# EAGLE schematic board (EAGLE 6.3)
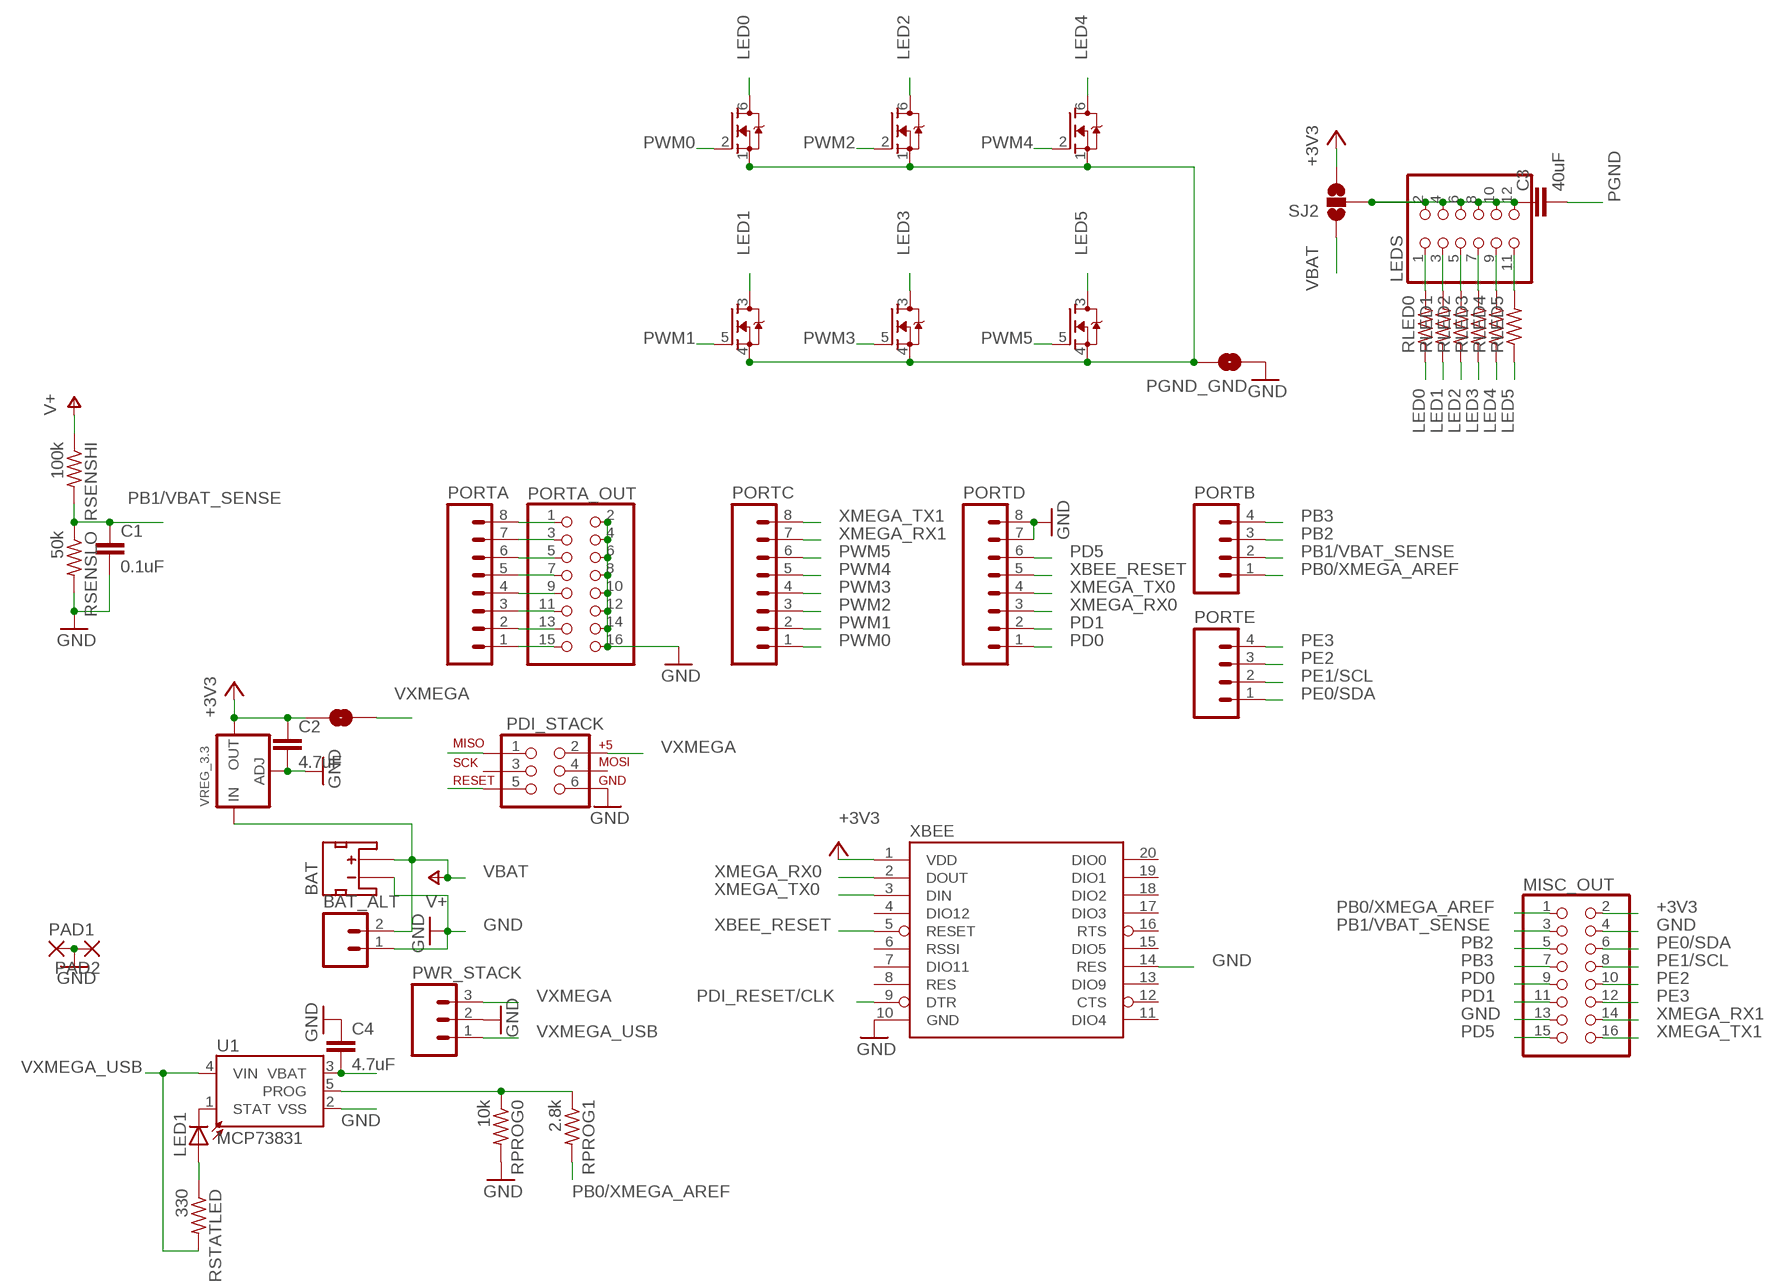
[diagram p0: schematic, sheet 1]

## Parts
+3.3V_VXMEGA  SOLDERJUMPERTRACE  [SJ_2S-TRACE]
BAT  JST_2MM_MALE  [JST-2-SMD]
BAT_ALT  M02PTH  [1X02]
C1  0.1uF  C-EUC0603K  [C0603K]
C2  4.7uF  C-EUC0805K  [C0805K]
C3  40uF  C-EUC1210  [C1210]
C4  4.7uF  C-EUC0805  [C0805]
DRV0  MOSFET-N_DUAL  [SOT363]
DRV1  MOSFET-N_DUAL  [SOT363]
DRV2  MOSFET-N_DUAL  [SOT363]
LED1  LEDCHIP-LED0603  [CHIP-LED0603]
LEDS  PINHD-2X6/90  [2X06/90]
MISC_OUT  PINHD-2X8/90  [2X08/90]
PAD1  3,81/1,4  [3,81/1,4]
PAD2  3,81/1,4  [3,81/1,4]
PDI_STACK  AVR_SPI_PRG_6NS  [2X3-NS]
PGND_GND  SOLDERJUMPERTRACE  [SJ_2S-TRACE]
PORTA  M081X08  [1X08]
PORTA_OUT  PINHD-2X8  [2X08]
PORTB  M04PTH  [1X04]
PORTC  M081X08  [1X08]
PORTD  M081X08  [1X08]
PORTE  M04PTH  [1X04]
PWR_STACK  M03PTH  [1X03]
RLED0  R-US_R0805  [R0805]
RLED1  R-US_R0805  [R0805]
RLED2  R-US_R0805  [R0805]
RLED3  R-US_R0805  [R0805]
RLED4  R-US_R0805  [R0805]
RLED5  R-US_R0805  [R0805]
RPROG0  10k  R-US_R0603  [R0603]
RPROG1  2.8k  R-US_R0603  [R0603]
RSENSHI  100k  R-US_R0603  [R0603]
RSENSLO  50k  R-US_R0603  [R0603]
RSTATLED  330  R-US_R0603  [R0603]
SJ2  SOLDERJUMPER_2WAY-OLDT  [SJ_2]
U1  MCP73831  [SOT23-5]
VREG_3.3  LM1117SOT223-WAVE  [SOT223-W]
XBEE  XBEE-1B2  [XBEE-SILK]

## Nets
+3V3 [PWR]: +3.3V_VXMEGA.1 C2.1 MISC_OUT.2 SJ2.3 VREG_3.3.2(OUT) XBEE.1(VDD)
GND [PWR]: BAT.1(-) BAT_ALT.1 C1.2 C2.2 C4.1 MISC_OUT.4 MISC_OUT.13 PAD1.1(P) PAD2.1(P) PDI_STACK.6 PGND_GND.1 PORTA_OUT.2 PORTA_OUT.4 PORTA_OUT.6 PORTA_OUT.8 PORTA_OUT.10 PORTA_OUT.12 PORTA_OUT.14 PORTA_OUT.16 PORTD.7 PORTD.8 PWR_STACK.2 RPROG0.2 RSENSLO.2 U1.2(VSS) VREG_3.3.1(ADJ) XBEE.10(GND) XBEE.14(RES)
LED0 [PWR]: DRV0.6(D) RLED0.1
LED0R [PWR]: LEDS.1 RLED0.2
LED1 [PWR]: DRV0.3(D) RLED1.1
LED1R [PWR]: LEDS.3 RLED1.2
LED2 [PWR]: DRV1.6(D) RLED2.1
LED2R [PWR]: LEDS.5 RLED2.2
LED3 [PWR]: DRV1.3(D) RLED3.1
LED3R [PWR]: LEDS.7 RLED3.2
LED4 [PWR]: DRV2.6(D) RLED4.1
LED4R [PWR]: LEDS.9 RLED4.2
LED5 [PWR]: DRV2.3(D) RLED5.1
LED5R [PWR]: LEDS.11 RLED5.2
N$2: LED1.C U1.1(STAT)
N$3: LED1.A RSTATLED.1
PA0: PORTA.1 PORTA_OUT.15
PA1: PORTA.2 PORTA_OUT.13
PA2: PORTA.3 PORTA_OUT.11
PA3: PORTA.4 PORTA_OUT.9
PA4: PORTA.5 PORTA_OUT.7
PA5: PORTA.6 PORTA_OUT.5
PA6: PORTA.7 PORTA_OUT.3
PA7: PORTA.8 PORTA_OUT.1
PB0/XMEGA_AREF: MISC_OUT.1 PORTB.1 RPROG1.2
PB1/VBAT_SENSE: C1.1 MISC_OUT.3 PORTB.2 RSENSHI.2 RSENSLO.1
PB2: MISC_OUT.5 PORTB.3
PB3: MISC_OUT.7 PORTB.4
PD0: MISC_OUT.9 PORTD.1
PD1: MISC_OUT.11 PORTD.2
PD5: MISC_OUT.15 PORTD.6
PDI_DATA: PDI_STACK.1
PDI_RESET/CLK: PDI_STACK.5 XBEE.9(DTR)
PE0/SDA: MISC_OUT.6 PORTE.1
PE1/SCL: MISC_OUT.8 PORTE.2
PE2: MISC_OUT.10 PORTE.3
PE3: MISC_OUT.12 PORTE.4
PGND [PWR]: C3.2 DRV0.1(S) DRV0.4(S) DRV1.1(S) DRV1.4(S) DRV2.1(S) DRV2.4(S) PGND_GND.2
PWM0: DRV0.2(G) PORTC.1
PWM1: DRV0.5(G) PORTC.2
PWM2: DRV1.2(G) PORTC.3
PWM3: DRV1.5(G) PORTC.4
PWM4: DRV2.2(G) PORTC.5
PWM5: DRV2.5(G) PORTC.6
RPROG: RPROG0.1 RPROG1.1 U1.5(PROG)
VBAT [PWR]: BAT.2(+) BAT_ALT.2 C4.2 RSENSHI.1 SJ2.1 U1.3(VBAT) VREG_3.3.3(IN) ; supply symbol labelled V+
VLED [PWR]: C3.1 LEDS.2 LEDS.4 LEDS.6 LEDS.8 LEDS.10 LEDS.12 SJ2.2
VXMEGA: +3.3V_VXMEGA.2 PDI_STACK.2 PWR_STACK.3
VXMEGA_USB [PWR]: PWR_STACK.1 RSTATLED.2 U1.4(VIN)
XBEE_RESET: PORTD.5 XBEE.5(RESET)
XMEGA_RX0: PORTD.3 XBEE.2(DOUT)
XMEGA_RX1: MISC_OUT.14 PORTC.7
XMEGA_TX0: PORTD.4 XBEE.3(DIN)
XMEGA_TX1: MISC_OUT.16 PORTC.8
Unconnected: BAT.NC1(PAD1) BAT.NC2(PAD2) PDI_STACK.3 PDI_STACK.4 XBEE.4(DIO12) XBEE.6(RSSI) XBEE.7(DIO11) XBEE.8(RES) XBEE.11(DIO4) XBEE.12(CTS) XBEE.13(DIO9) XBEE.15(DIO5) XBEE.16(RTS) XBEE.17(DIO3) XBEE.18(DIO2) XBEE.19(DIO1) XBEE.20(DIO0)

## Library data of the parts
+3.3V_VXMEGA PGND_GND = SparkFun-Passives:SOLDERJUMPER: Solder Jumper Standard SMD solder jumper. Used to automate production. Two varients : Normally Open and Normally Closed are the same, but have different paste layers. NC will have a large amount of paste and should jumper during reflow.
BAT = SparkFun-Connectors:JST_2MM_MALE: Mates to single-cell LiPo batteries. CONN-08352; PROD_ID: CONN-08352
BAT_ALT = SparkFun-Connectors:M02: Header 2 Standard 2-pin 0.1" header. Use with straight break away headers (SKU : PRT-00116), right angle break away headers (PRT-00553), swiss pins (PRT-00743), machine pins (PRT-00117), and female headers (PRT-00115). Molex polarized connector foot print use with SKU : PRT-08233 with associated crimp pins and housings.
C1-C4 = rcl:C-EU: CAPACITOR, European symbol
DRV0 DRV1 DRV2 = microbuilder:MOSFET-N_DUAL: Dual N-Channel MOSFET SOT363 (2.0x1.25mm) 2N7002PS - 60V, 320mA [Digikey: 568-5984-1-ND]
LED1 = led:LED: LED OSRAM: - CHIPLED LG R971, LG N971, LY N971, LG Q971, LY Q971, LO R971, LY R971 LH N974, LH R974 LS Q976, LO Q976, LY Q976 LO Q996 - Hyper CHIPLED LW Q18S LB Q993, LB Q99A, LB R99A - SideLED LS A670, LO A670, LY A670, LG A670, LP A670 LB A673, LV A673, LT A673, LW A673 LH A674 LY A675 LS A676, LA A676, LO A676, LY A676, LW A676 LS A679, LY A679, LG A679 - Hyper Micro SIDELED® LS Y876, LA Y876, LO Y876, LY Y876 LT Y87S - SmartLED LW L88C, LW L88S LB L89C, LB L89S, LG L890 LS L89K, LO L89K, LY L89K LS L896, LA L896, LO L896, LY L896 - TOPLED LS T670, LO T670, LY T670, LG T670, LP T670 LSG T670, LSP T670, LSY T670, LOP T670, LYG T670 LG T671, LOG T671, LSG T671 LB T673, LV T673, LT T673, LW T673 LH T674 LS T676, LA T676, LO T676, LY T676, LB T676, LH T676, LSB T676, LW T676 LB T67C, LV T67C, LT T67C, LS T67K, LO T67K, LY T67K, LW E67C LS E67B, LA E67B, LO E67B, LY E67B, LB E67C, LV E67C, LT E67C LW T67C LS T679, LY T679, LG T679 LS T770, LO T770, LY T770, LG T770, LP T770 LB T773, LV T773, LT T773, LW T773 LH T774 LS E675, LA E675, LY E675, LS T675 LS T776, LA T776, LO T776, LY T776, LB T776 LHGB T686 LT T68C, LB T68C - Hyper Mini TOPLED® LB M676 - Mini TOPLED Santana® LG M470 LS M47K, LO M47K, LY M47K Source: http://www.osram.convergy.de LUXEON: - LUMILED® LXK2-PW12-R00, LXK2-PW12-S00, LXK2-PW14-U00, LXK2-PW14-V00 LXK2-PM12-R00, LXK2-PM12-S00, LXK2-PM14-U00 LXK2-PE12-Q00, LXK2-PE12-R00, LXK2-PE12-S00, LXK2-PE14-T00, LXK2-PE14-U00 LXK2-PB12-K00, LXK2-PB12-L00, LXK2-PB12-M00, LXK2-PB14-N00, LXK2-PB14-P00, LXK2-PB14-Q00 LXK2-PR12-L00, LXK2-PR12-M00, LXK2-PR14-Q00, LXK2-PR14-R00 LXK2-PD12-Q00, LXK2-PD12-R00, LXK2-PD12-S00 LXK2-PH12-R00, LXK2-PH12-S00 LXK2-PL12-P00, LXK2-PL12-Q00, LXK2-PL12-R00 Source: www.luxeon.com KINGBRIGHT: KA-3528ASYC Source: www.kingbright.com
LEDS = pinhead:PINHD-2X6: PIN HEADER
MISC_OUT PORTA_OUT = pinhead:PINHD-2X8: PIN HEADER
PAD1 PAD2 = wirepad:3,81/1,4: THROUGH-HOLE PAD
PDI_STACK = SparkFun-Connectors:AVR_SPI_PRG_6: AVR ISP 6 Pin This is the reduced ISP connector for AVR programming. Common on Arduino. This footprint will take up less PCB space and can be used with a 10-pin to 6-pin adapter such as SKU: BOB-08508
PORTA PORTC PORTD = SparkFun-Connectors:M08: Header 8 Standard 8-pin 0.1" header. Use with straight break away headers (SKU : PRT-00116), right angle break away headers (PRT-00553), swiss pins (PRT-00743), machine pins (PRT-00117), and female headers (PRT-00115).
PORTB PORTE = SparkFun-Connectors:M04: Header 4 Standard 4-pin 0.1" header. Use with straight break away headers (SKU : PRT-00116), right angle break away headers (PRT-00553), swiss pins (PRT-00743), machine pins (PRT-00117), and female headers (PRT-00115). Molex polarized connector foot print use with SKU : PRT-08231 with associated crimp pins and housings. 1MM SMD Version SKU: PRT-10208
PWR_STACK = SparkFun-Connectors:M03: Header 3 Standard 3-pin 0.1" header. Use with straight break away headers (SKU : PRT-00116), right angle break away headers (PRT-00553), swiss pins (PRT-00743), machine pins (PRT-00117), and female headers (PRT-00115). Molex polarized connector foot print use with SKU : PRT-08232 with associated crimp pins and housings.
RLED0 RLED1-RLED5 = resistor:R-US_: RESISTOR, American symbol
RPROG0 RPROG1 RSENSHI RSENSLO RSTATLED = rcl:R-US_: RESISTOR, American symbol
SJ2 = SparkFun-Passives:SOLDERJUMPER_2WAY-OLD: Solder Jumper 2 way solder jumper
U1 = SparkFun-PowerIC:MCP73831: Miniature single cell, fully integrated Li-Ion, Li-polymer charge management controller http://ww1.microchip.com/downloads/en/DeviceDoc/21984a.pdf
VREG_3.3 = microbuilder:LM1117: LM1117 Voltage Regulator LM1117 Adjustable Voltage regulator [Digikey: LM1117IMP-ADJDKR-ND] LM1117 3.3V Voltage regulator [AP1117E33GDIDKR-ND] LM1117 5.0V Voltage regulator [AP1117E50GDIDKR-ND] SOT223-REFLOW - SOT223 package for solder paste/reflow ovens SOT223-WAVE - SOT223 package for hand-soldering (larger pads) Note: For the fixed-voltage regulators, simply set the ADJ pin to GND.
XBEE = SparkFun-RF:XBEE-1: Xbee module footprints SMT header is CONN-09042.

## Net classes
1 PWR: width 0.305 mm